# Altium schematic sheet Shield.SchDoc
size A4; PageSetup: Record=PageOptions|CenterHorizontal=True|CenterVertical=True|PrintScale=0.98|XCorrection=1.00|YCorrection=1.00|PrintKind=2|BorderSize=5000000|LeftOffset=0|BottomOffset=0|Orientation=2|PaperLength=1000|PaperWidth=1000|Scale=100|PaperSource=7|PrintQuality=-4|MediaType=1|DitherType=10|PaperKind=A4|PrintScaleMode=1; DrawnBy: HENRIQUE THIESEN; Organization: Altium Limited; Address1: L3, 12a Rodborough Rd; Address2: Frenchs Forest; Address3: NSW; Address4: Australia 2086; DocumentNumber: 3; SheetNumber: 3; SheetTotal: 9; Project: WEG AirCon DAQ Adapter
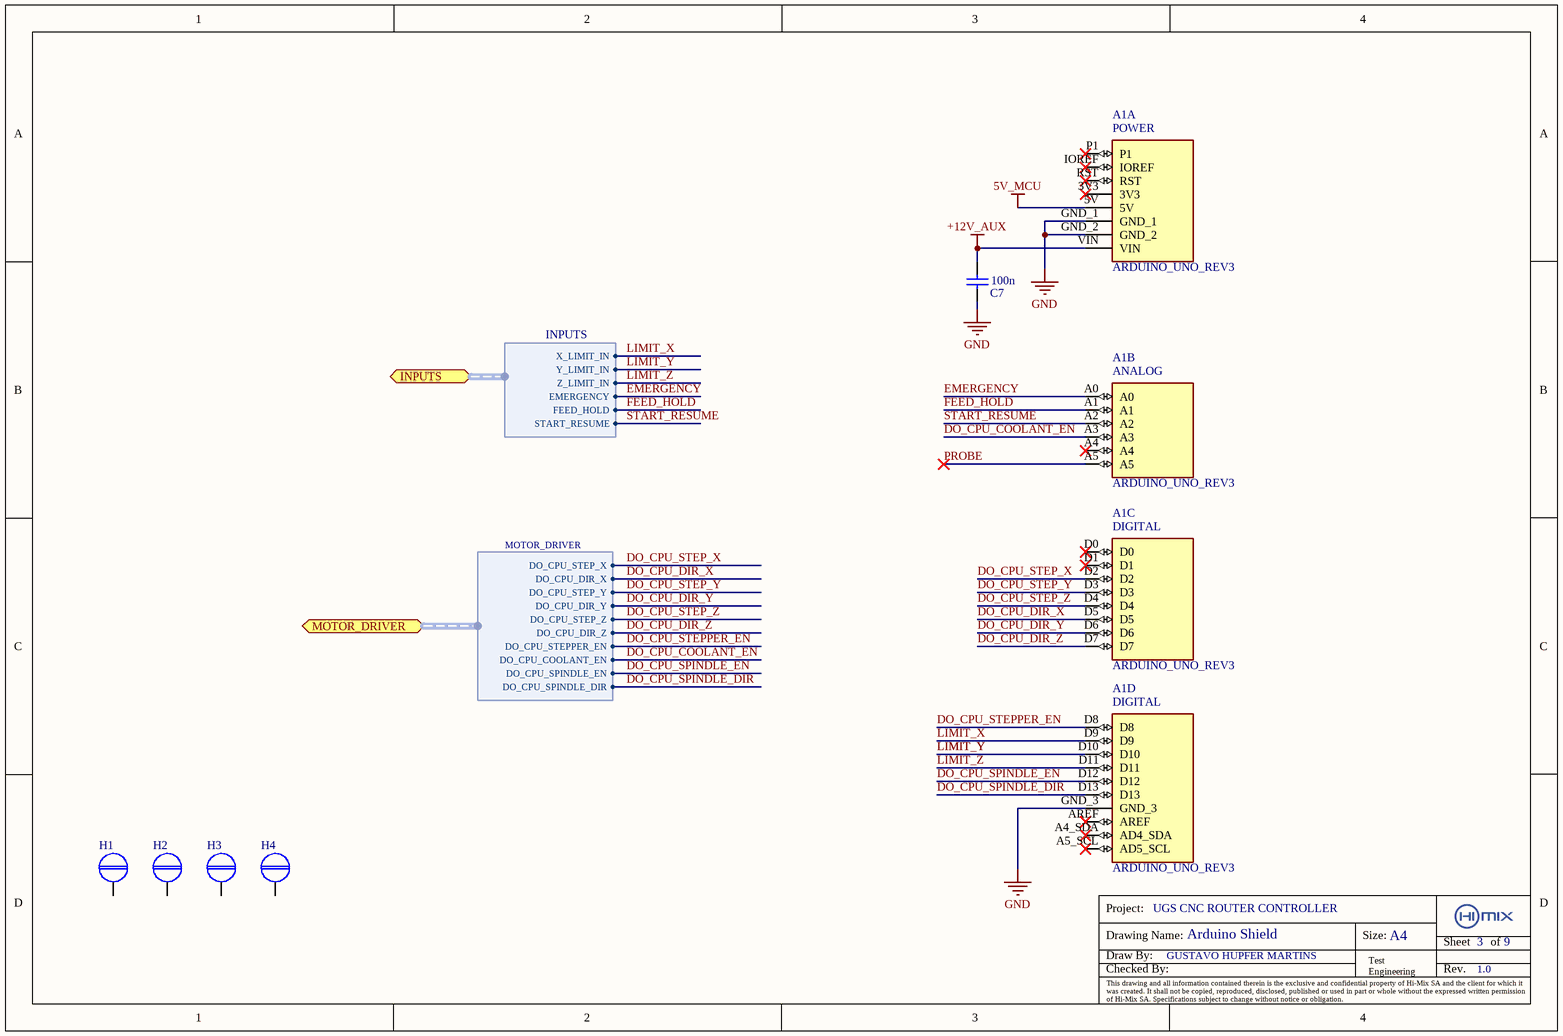
[diagram p0: Shield.SchDoc]

## Parts
A1  ARDUINO_UNO_REV3  [ARDUINO_ARDUINO_UNO_REV3]  (parts A,B,C,D of 4)
C7  value 100n  [SMT0805_M]  (hidden comment: Capacitor)
H1  Hole  [Hole 3.2mm x 6.5mm]  (value not drawn)  (no BOM)
H2  Hole  [Hole 3.2mm x 6.5mm]  (value not drawn)  (no BOM)
H3  Hole  [Hole 3.2mm x 6.5mm]  (value not drawn)  (no BOM)
H4  Hole  [Hole 3.2mm x 6.5mm]  (value not drawn)  (no BOM)

## Ports
INPUTS (harness INPUTS), MOTOR_DRIVER (harness MOTOR_DRIVER)

## Harnesses
MOTOR_DRIVER: DO_CPU_STEP_X, DO_CPU_STEP_Y, DO_CPU_STEP_Z, DO_CPU_DIR_X, DO_CPU_DIR_Y, DO_CPU_DIR_Z, DO_CPU_STEPPER_EN, DO_CPU_COOLANT_EN, DO_CPU_SPINDLE_EN, DO_CPU_SPINDLE_DIR
INPUTS: X_LIMIT_IN, Y_LIMIT_IN, Z_LIMIT_IN, EMERGENCY, FEED_HOLD, START_RESUME

## Nets
5V_MCU: A1.5V
+12V_AUX: A1.VIN C7.2
GND: A1.GND_1 A1.GND_2 A1.GND_3 C7.1
DO_CPU_COOLANT_EN: A1.A3 ; port MOTOR_DRIVER.DO_CPU_COOLANT_EN
DO_CPU_DIR_X: A1.D5 ; port MOTOR_DRIVER.DO_CPU_DIR_X
DO_CPU_DIR_Y: A1.D6 ; port MOTOR_DRIVER.DO_CPU_DIR_Y
DO_CPU_DIR_Z: A1.D7 ; port MOTOR_DRIVER.DO_CPU_DIR_Z
DO_CPU_SPINDLE_DIR: A1.D13 ; port MOTOR_DRIVER.DO_CPU_SPINDLE_DIR
DO_CPU_SPINDLE_EN: A1.D12 ; port MOTOR_DRIVER.DO_CPU_SPINDLE_EN
DO_CPU_STEP_X: A1.D2 ; port MOTOR_DRIVER.DO_CPU_STEP_X
DO_CPU_STEP_Y: A1.D3 ; port MOTOR_DRIVER.DO_CPU_STEP_Y
DO_CPU_STEP_Z: A1.D4 ; port MOTOR_DRIVER.DO_CPU_STEP_Z
DO_CPU_STEPPER_EN: A1.D8 ; port MOTOR_DRIVER.DO_CPU_STEPPER_EN
EMERGENCY: A1.A0 ; port INPUTS.EMERGENCY
FEED_HOLD: A1.A1 ; port INPUTS.FEED_HOLD
LIMIT_X: A1.D9 ; port INPUTS.X_LIMIT_IN
LIMIT_Y: A1.D10 ; port INPUTS.Y_LIMIT_IN
LIMIT_Z: A1.D11 ; port INPUTS.Z_LIMIT_IN
PROBE: A1.A5
START_RESUME: A1.A2 ; port INPUTS.START_RESUME

Not connected (* = marked no-connect by the designer): A1 3V3* A4* A4_SDA(AD4_SDA)* A5_SCL(AD5_SCL)* AREF* D0* D1* IOREF* P1* RST*; H1 1; H2 1; H3 1; H4 1

## Notes on the sheet
- UGS CNC ROUTER CONTROLLER
- GUSTAVO HUPFER MARTINS
- Arduino Shield
- 1.0
- Project:
- Drawing Name:
- Checked By:
- Draw By:
- Size:
- Test
  Engineering
- A4
- Sheet
- Rev.
- of
- This drawing and all information contained therein is the exclusive and confidential property of Hi-Mix SA and the client for which it was created. It shall not be copied, reproduced, disclosed, published or used in part or whole without the expressed written permission of Hi-Mix SA. Specifications subject to change without notice or obligation.
- (in symbol ARDUINO_UNO_REV3, part A) POWER
- (in symbol ARDUINO_UNO_REV3, part B) ANALOG
- (in symbol ARDUINO_UNO_REV3, part C) DIGITAL
- (in symbol ARDUINO_UNO_REV3, part D) DIGITAL

## Library data of the parts
A1 = ARDUINO_UNO_REV3: Microcontroller board based on the ATmega328P.; MP: ARDUINO UNO REV3; SnapEDA_Link: https://www.snapeda.com/parts/ARDUINO%20UNO%20REV3/Arduino/view-part/?ref=snap; Package: Non-Standard Arduino; Value: *; MF: Arduino; Check_prices: https://www.snapeda.com/parts/ARDUINO%20UNO%20REV3/Arduino/view-part/?ref=eda
C7 = Capacitor: Published: 8-Jun-2000; LatestRevisionDate: 17-Jul-2002; LatestRevisionNote: Re-released for DXP Platform.; PackageReference: RAD-0.3; Publisher: Altium Limited; PackageDescription: Radial Cap, Thru-Hole; 2 Leads; 0.3 in Pin Spacing